# EasyEDA schematic LcsNodes-Building-Block-Generic-Power-Supply.json
TITLE: Generic Power Supply with Powerfail Option; REV: 1.0; Date: 2022-09-19; Sheet: 1/1; Drawn By: helmut-f; Company: Your Company
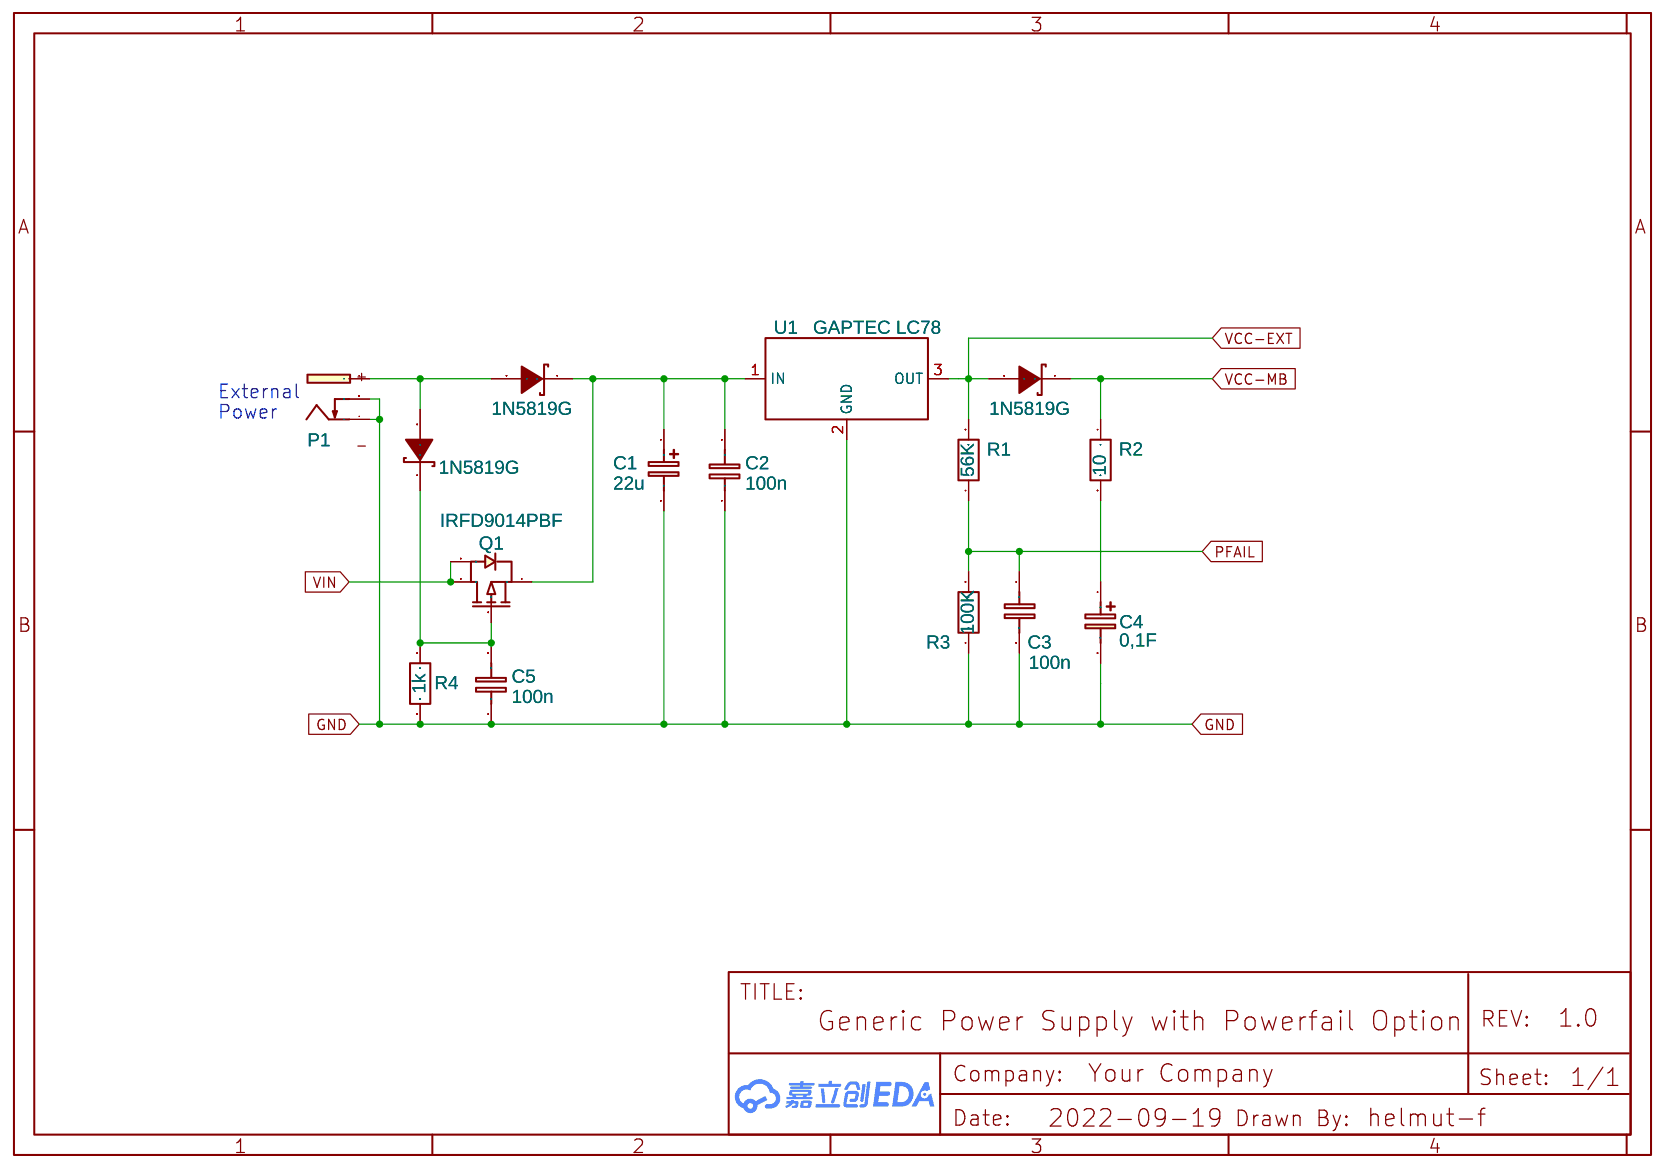
[diagram p0: schematic sheet]

## Parts
A1  1N5819G  [DO-41]
A2  1N5819G  [DO-41]
A3  1N5819G  [DO-41]
C1  22u  [CAP-D6.3×F2.5]
C2  100n  [RAD-0.2]
C3  100n  [RAD-0.2]
C4  0,1F  [CASE-A_3216]
C5  100n  [RAD-0.2]
P1  External Power  [DCSKTP]
Q1  IRFD9014PBF  [HVMDIP-4_L4.9-W6.2-P2.54-LS7.7-BL]
R1  56K  [R_AXIAL-0.3]
R2  10  [R_AXIAL-0.3]
R3  100K  [R_AXIAL-0.3]
R4  1k  [R_AXIAL-0.3]
U1  GAPTEC LC78  [GAPTEC_LC78]

## Library data of the parts
A1-A3 = 1N5819G: Diode Schottky 40V 1A Through Hole Axial; Supplier: Digi-Key; Supplier Part: 1N5819GOS-ND; Manufacturer: ON Semiconductor; Contributor: James Bao; link: http://www.onsemi.com/pub/Collateral/1N5817-D.PDF
C1 = CE_TH_D4.0×F1.5_EU: Contributor: LCEDA_Lib
C2 C5 = C_0603_EU: Contributor: LCEDA_Lib
C3 = C_RAD-0.2_EU: Contributor: LCEDA_Lib
C4 = C_Tan_SMD_A_EU: Contributor: LCEDA_Lib
P1 = DC21P: Package Display: No
Q1 = IRFD9014PBF: Supplier: LCSC; Supplier Part: C727522; Manufacturer: VISHAY(威世); Contributor: LCSC
R1-R4 = R_AXIAL-0.3_EU: Contributor: LCEDA_Lib
U1 = GAPTEC LC78: Contributor: kbasten

## Nets
GND: C1.2 C2.1 C3.2 C4.2 C5.1 P1.- P1.C R3.1 R4.2 U1.2(GND)
VCC-EXT: A2.2(A) R1.2 U1.3(OUT)
VCC-MB: A2.1(K) R2.1
VIN: Q1.1(D) Q1.2(D)
PFAIL: C3.1 R1.1 R3.2
Net-(A1-1): A1.1(K) C1.1 C2.2 Q1.4(S) U1.1(IN)
Net-(A1-2): A1.2(A) A3.2(A) P1.+
Net-(A3-1): A3.1(K) C5.2 Q1.3(G) R4.1
Net-(C4-1): C4.1 R2.2

## Notes on the sheet
- External
- Power
